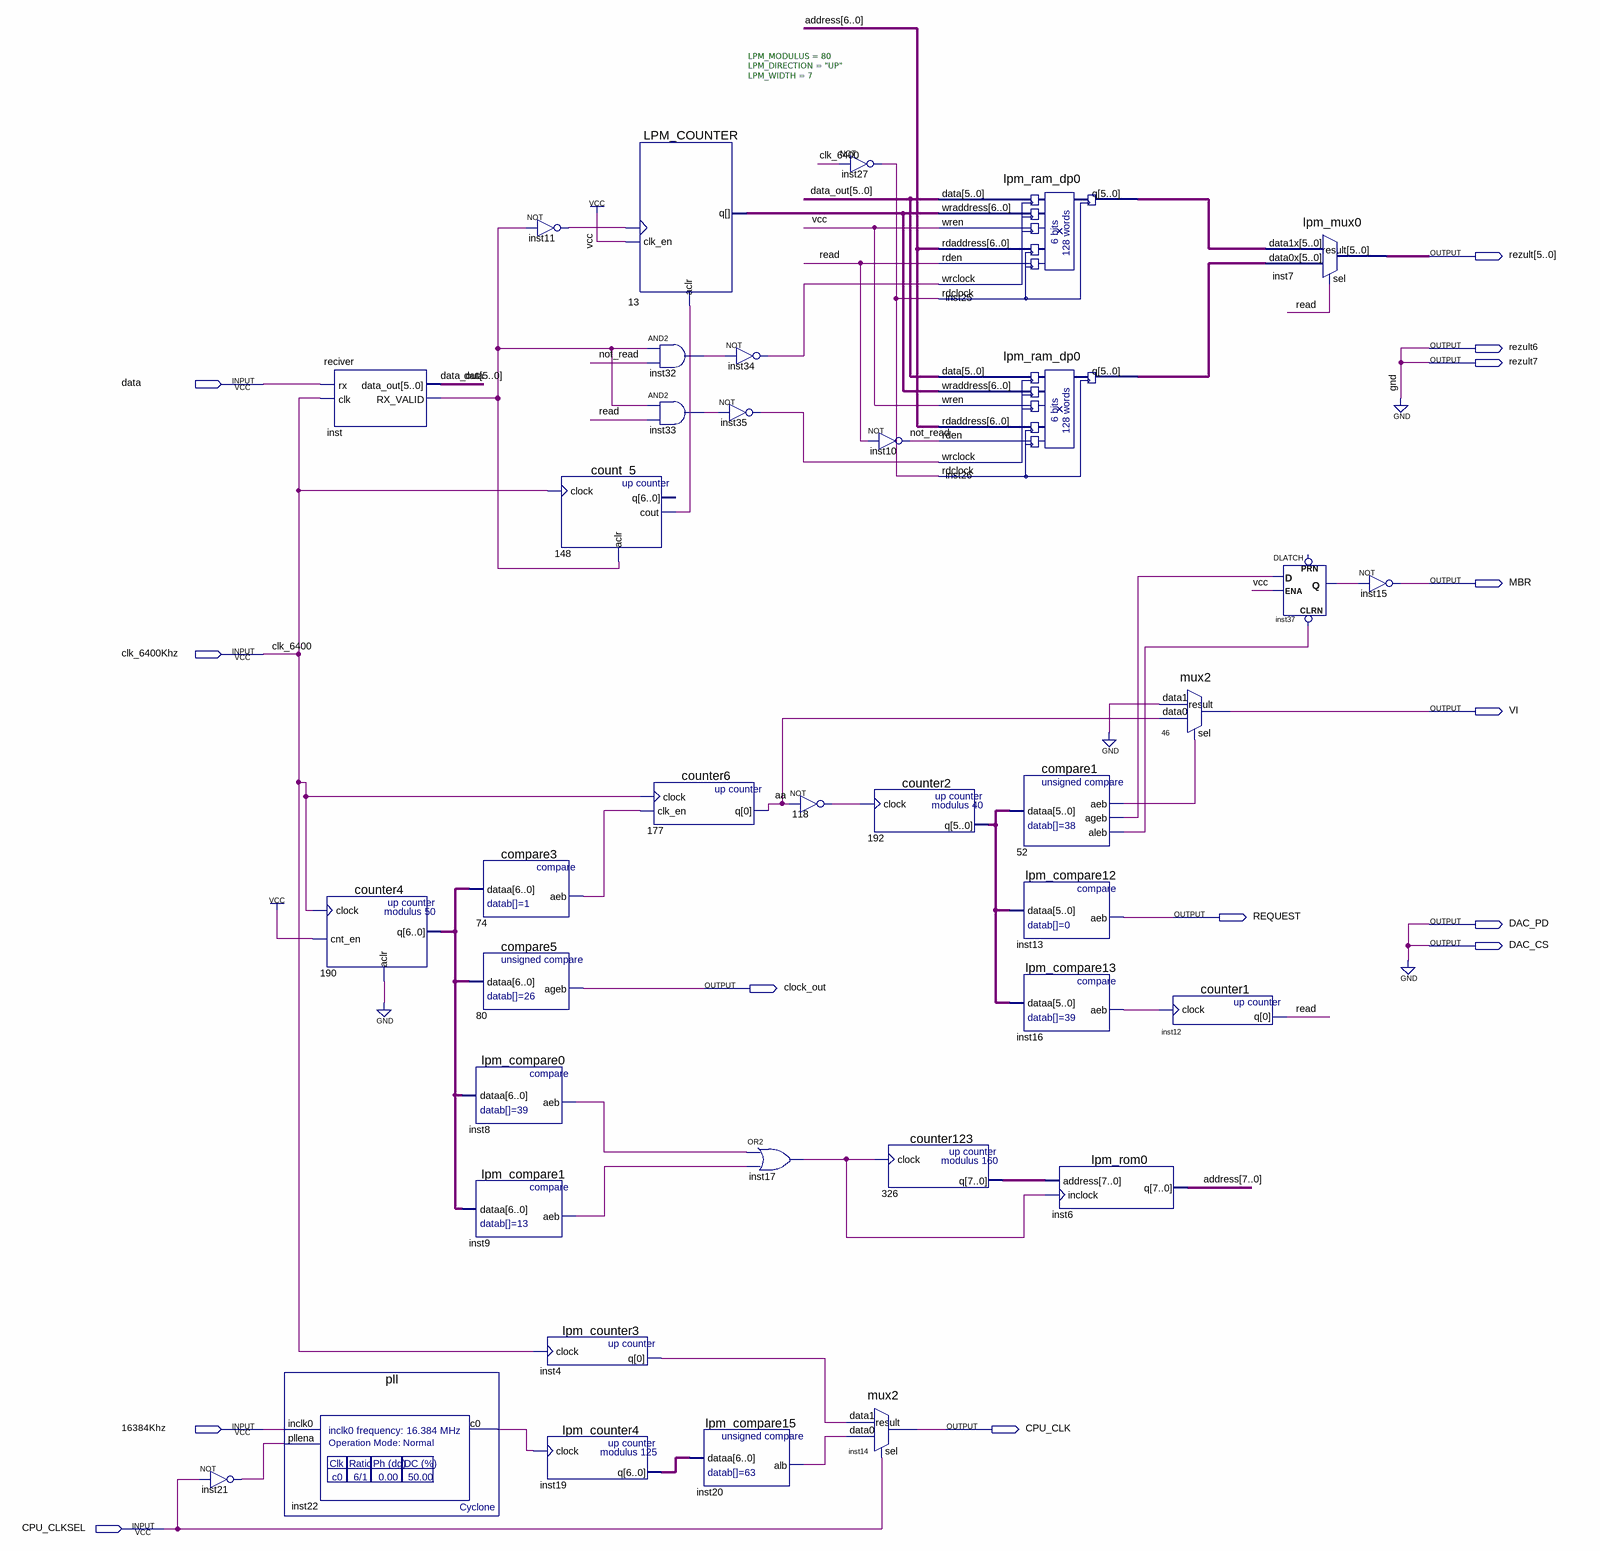
[diagram p0: schematic sheet]
// Quartus schematic project.bdf as structural Verilog: 37 symbols, 14 pins
module project (
  input  data,
  input  clk_6400Khz,
  input  \16384Khz ,
  input  CPU_CLKSEL,
  output [5:0] rezult,
  output rezult6,
  output rezult7,
  output MBR,
  output VI,
  output REQUEST,
  output DAC_PD,
  output DAC_CS,
  output clock_out,
  output CPU_CLK
);

  wire aa, inst4_q, inst8_aeb, inst9_aeb, inst11_out, inst16_aeb, inst17_out, inst20_alb, inst21_out,
       inst22_c0, inst27_out, inst32_out, inst33_out, inst34_out, inst35_out, inst37_q, inst_rx_valid,
       n52_aeb, n52_ageb, n52_aleb, n74_aeb, n118_out, n148_cout, not_read, read;
  wire [5:0] data_out, inst25_q, inst26_q, n192_q;
  wire [6:0] inst19_q, n13_q, n190_q;
  wire [7:0] address, n326_q;

  not inst21 (inst21_out, CPU_CLKSEL);
  pll inst22 (.inclk0(\16384Khz ), .pllena(inst21_out), .c0(inst22_c0));
  reciver inst (.rx(data), .clk(clk_6400Khz), .data_out(data_out), .RX_VALID(inst_rx_valid));
  counter4 u_190 (.clock(clk_6400Khz), .cnt_en(1'b1), .aclr(1'b0), .q(n190_q));
  lpm_compare0 inst8 (.dataa(n190_q), .aeb(inst8_aeb));
  lpm_compare1 inst9 (.dataa(n190_q), .aeb(inst9_aeb));
  compare3 u_74 (.dataa(n190_q), .aeb(n74_aeb));
  compare5 u_80 (.dataa(n190_q), .ageb(clock_out));
  not inst11 (inst11_out, inst_rx_valid);
  count_5 u_148 (.clock(clk_6400Khz), .aclr(inst_rx_valid), .cout(n148_cout));  // open: q
  lpm_counter3 inst4 (.clock(clk_6400Khz), .q(inst4_q));
  lpm_counter4 inst19 (.clock(inst22_c0), .q(inst19_q));
  LPM_COUNTER #(.LPM_MODULUS(80), .LPM_DIRECTION("UP"), .LPM_WIDTH(7)) u_13 (
    .clock(inst11_out), .clk_en(1'b1), .aclr(n148_cout), .q(n13_q));
  and inst32 (inst32_out, inst_rx_valid, not_read);
  and inst33 (inst33_out, inst_rx_valid, read);
  counter6 u_177 (.clock(clk_6400Khz), .clk_en(n74_aeb), .q(aa));
  lpm_compare15 inst20 (.dataa(inst19_q), .alb(inst20_alb));
  not inst34 (inst34_out, inst32_out);
  not inst35 (inst35_out, inst33_out);
  or inst17 (inst17_out, inst8_aeb, inst9_aeb);
  not u_118 (n118_out, aa);
  not inst27 (inst27_out, clk_6400Khz);
  counter2 u_192 (.clock(n118_out), .q(n192_q));
  mux2 inst14 (.data1(inst4_q), .data0(inst20_alb), .sel(CPU_CLKSEL), .result(CPU_CLK));
  not inst10 (not_read, read);
  counter123 u_326 (.clock(inst17_out), .q(n326_q));
  lpm_ram_dp0 inst25 (
    .data(data_out), .wraddress(n13_q), .wren(1'b1), .rdaddress(address[6:0]), .rden(read),
    .wrclock(inst34_out), .rdclock(inst27_out), .q(inst25_q));
  lpm_ram_dp0 inst26 (
    .data(data_out), .wraddress(n13_q), .wren(1'b1), .rdaddress(address[6:0]), .rden(not_read),
    .wrclock(inst35_out), .rdclock(inst27_out), .q(inst26_q));
  compare1 u_52 (.dataa(n192_q), .aeb(n52_aeb), .ageb(n52_ageb), .aleb(n52_aleb));
  lpm_compare12 inst13 (.dataa(n192_q), .aeb(REQUEST));
  lpm_compare13 inst16 (.dataa(n192_q), .aeb(inst16_aeb));
  lpm_rom0 inst6 (.address(n326_q), .inclock(inst17_out), .q(address));
  mux2 u_46 (.data1(1'b0), .data0(aa), .sel(n52_aeb), .result(VI));
  counter1 inst12 (.clock(inst16_aeb), .q(read));
  lpm_mux0 inst7 (.data1x(inst25_q), .data0x(inst26_q), .sel(read), .result(rezult));
  DLATCH inst37 (.CLRN(n52_aleb), .D(n52_ageb), .ENA(1'b1), .Q(inst37_q));  // open: PRN
  not inst15 (MBR, inst37_q);

  assign DAC_CS = 1'b0;
  assign DAC_PD = 1'b0;
  assign rezult6 = 1'b0;
  assign rezult7 = 1'b0;

  // Other names for the same wires on the sheet: clk_6400 = clk_6400Khz
endmodule
